# Altium schematic sheet 12_fit_YK.SchDoc
size A4; SheetNumber: 3; SheetTotal: 3
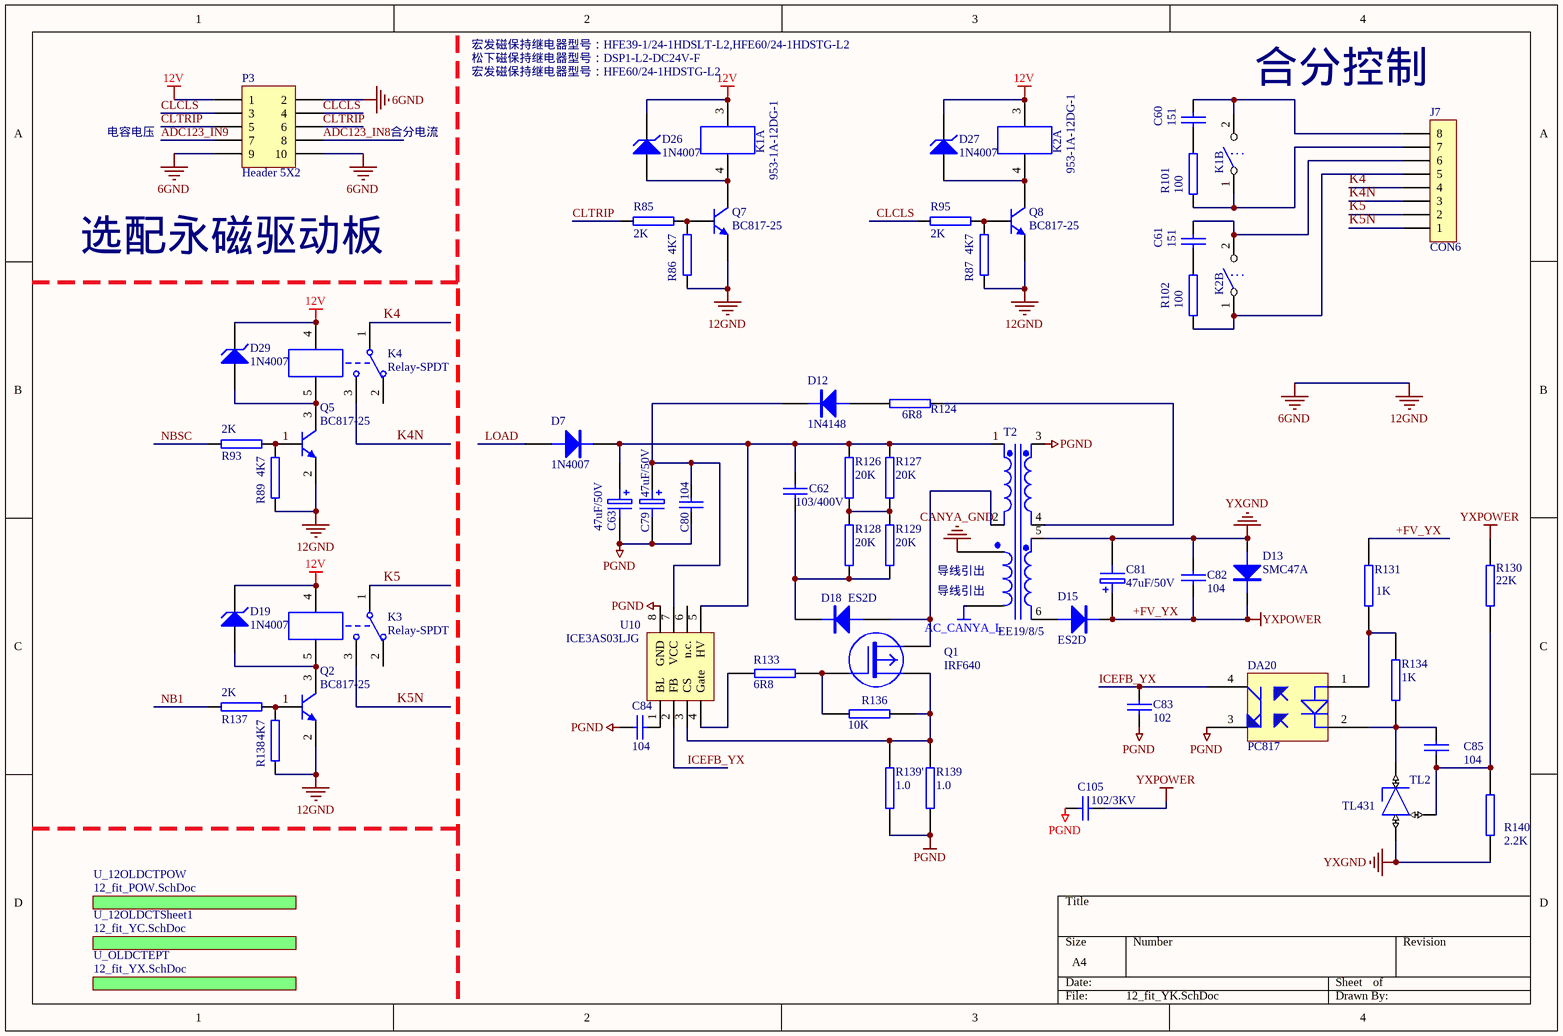
[diagram p0: 12_fit_YK.SchDoc]

## Parts
C60  151  [CAP_HV_10]
C61  151  [CAP_HV_10]
C62  103/400V  [CAP_HV_8]
C63  47uF/50V  [47u/50V]
C79  47uF/50V  [47u/50V]
C80  104  [C1206]
C81  47uF/50V  [47u/50V]
C82  104  [CBB104]
C83  102  [C1206]
C84  104  [C1206]
C85  104  [CBB104]
C105  102/3KV  [CAP_HV_8]
D7  1N4007  [DO-214AA]
D12  1N4148  [SMT_4148]
D13  SMC47A  [DO-214AB]
D15  ES2D  [DO-214AA]
D18  ES2D  [DO-214AA]
D19  1N4007  [DO-214AC]
D26  1N4007  [DO-214AC]
D27  1N4007  [DO-214AC]
D29  1N4007  [DO-214AC]
DA20  PC817  [dip4]
J7  CON6  [XR_POWER5.08_8_弯]
K1  953-1A-12DG-1  [953-1A-12DG-1]  (parts A,B of 2)
K2  953-1A-12DG-1  [953-1A-12DG-1]  (parts A,B of 2)
K3  Relay-SPDT  [JQX-115FA]
K4  Relay-SPDT  [JQX-115FA]
P3  Header 5X2  [HDR2X5]
Q1  IRF640  [TO220-IRF540]
Q2  BC817-25  [SOT-23]
Q5  BC817-25  [SOT-23]
Q7  BC817-25  [SOT-23]
Q8  BC817-25  [SOT-23]
R85  2K  [R1206]
R86  4K7  [R1206]
R87  4K7  [R1206]
R89  4K7  [R1206]
R93  2K  [R1206]
R95  2K  [R1206]
R101  100  [res-l5]
R102  100  [res-l5]
R124  6R8  [R1206]
R126  20K  [R1206]
R127  20K  [R1206]
R128  20K  [R1206]
R129  20K  [R1206]
R130  22K  [R1206]
R131  1K  [R1206]
R133  6R8  [R1206]
R134  1K  [R1206]
R136  10K  [R1206]
R137  2K  [R1206]
R138  4K7  [R1206]
R139  1.0  [R2512]
R139'  1.0  [R2512]
R140  2.2K  [R1206]
T2  EE19/8/5  [EE19/8/5]
TL2  TL431  [SOT-23]
U10  ICE3AS03LJG  [SO8]

## Sub-sheets
U_12OLDCTPOW = 12_fit_POW.SchDoc: no entries
U_12OLDCTSheet1 = 12_fit_YC.SchDoc: no entries
U_OLDCTEPT = 12_fit_YX.SchDoc: no entries

## Nets
12GND: P3.2 P3.9 P3.10 Q2.2(E) Q5.2(E) Q7.2(E) Q8.2(E) R86.1 R87.1 R89.1 R138.1  [also labelled 6GND]
12V: D19.2(K) D26.2(K) D27.2(K) D29.2(K) K1.3 K2.3 K3.4 K4.4 P3.1
+FV_YX: C81.1 C82.1 C105.2 D13.2(K) D15.2(K) R130.2 R131.2  [also labelled YXPOWER]
PGND: C63.2 C79.2 C80.1 C83.1 C84.1 C105.1 DA20.3 R139.1 R139'.1 T2.3(Sec1+) U10.8(GND)
YXGND: C81.2 C82.2 D13.1(A) R140.1 T2.5(Sec2+) TL2.3(A)
ADC123_IN8: P3.8
ADC123_IN9: P3.7
CLCLS: P3.3 P3.4 R95.1
CLTRIP: P3.5 P3.6 R85.1
ICEFB_YX: C83.2 DA20.4 U10.2(FB)
K4: J7.4 K4.1
K4N: J7.3 K4.3
K5: J7.2 K3.1
K5N: J7.1 K3.3
LOAD: D7.1(A)
NB1: R137.1
NBSC: R93.1
NetC60_1: C60.1 R101.1
NetC60_2: C60.2 J7.8 K1.2
NetC61_1: C61.1 J7.6 K2.2
NetC61_2: C61.2 R102.1
NetC62_1: C62.1 D18.2(K) R128.1 R129.1
NetC62_2: C62.2 C63.1 D7.2(K) R126.2 R127.2 T2.1(Pri+) U10.5(HV)
NetC79_1: C79.1 C80.2 D12.2(K) U10.7(VCC)
NetC84_2: C84.2 U10.1(BL)
NetC85_1: C85.1 DA20.2 R134.1 TL2.1(K)
NetC85_2: C85.2 R130.1 R140.2 TL2.2(R)
NetD12_1: D12.1(A) R124.1
NetD15_1: D15.1(A) T2.6(Sec2-)
NetD18_1: D18.1(A) Q1.2(D) T2.2(Pri-)
NetD19_1: D19.1(A) K3.5 Q2.3(C)
NetD26_1: D26.1(A) K1.4 Q7.3(C)
NetD27_1: D27.1(A) K2.4 Q8.3(C)
NetD29_1: D29.1(A) K4.5 Q5.3(C)
NetDA20_1: DA20.1 R131.1 R134.2
NetJ7_5: J7.5 K2.1 R102.2
NetJ7_7: J7.7 K1.1 R101.2
NetQ1_1: Q1.1(G) R133.1 R136.2
NetQ1_3: Q1.3(S) R136.1 R139.2 R139'.2 U10.3(CS)
NetQ2_1: Q2.1(B) R137.2 R138.2
NetQ5_1: Q5.1(B) R89.2 R93.2
NetQ7_1: Q7.1(B) R85.2 R86.2
NetQ8_1: Q8.1(B) R87.2 R95.2
NetR124_2: R124.2 T2.4(Sec1-)
NetR126_1: R126.1 R127.1 R128.2 R129.2
NetR133_2: R133.2 U10.4(Gate)

Not connected (* = marked no-connect by the designer): K3 2; K4 2; U10 6(n.c.)

## Notes on the sheet
- 宏发磁保持继电器型号：HFE39-1/24-1HDSLT-L2,HFE60/24-1HDSTG-L2
- 松下磁保持继电器型号：DSP1-L2-DC24V-F
- 宏发磁保持继电器型号：HFE60/24-1HDSTG-L2
- 合分控制
- 电容电压
- 合分电流
- 选配永磁驱动板
- 导线引出
- Labels drawn without touching a wire or pin: AC_CANYA_L, CANYA_GND

## Library data of the parts
C60-C62 C83 = CAP
C63 C79 C81 = ELECTRO1: Electrolytic Capacitor
C80 C82 C84 C85 C105 = CAP: Capacitor
D7 D12 D13 D15 D18 = DIODE
D19 D26 D27 D29 = D Zener: Zener Diode; Published: 8-Jun-2000; LatestRevisionDate: 17-Jul-2002; LatestRevisionNote: Re-released for DXP Platform.; PackageReference: DIODE-0.7; Publisher: Altium Limited; PackageDescription: Diode, Thru-Hole; 2 Leads; 0.7 in Pin Spacing
DA20 = TLP521-1
J7 = CON8: Connector
K1 K2 = RLY-STY1: RELAY
K3 K4 = Relay-SPDT: Single-Pole Dual-Throw Relay; Published: 24-Mar-1999; LatestRevisionDate: 17-Jul-2002; LatestRevisionNote: Re-released for DXP Platform.; PackageReference: MODULE5B; Publisher: Altium Limited
P3 = Header 5X2: Header, 5-Pin, Dual row; LatestRevisionDate: 17-Jul-2002; LatestRevisionNote: Re-released for DXP Platform.; Publisher: Altium Limited
Q1 = MOSFET-P1
Q2 Q5 Q7 Q8 = SOT-23 2SC3356-T1B-A    S/YS档: NPN; ComponentLink1Description: 供应商链接; ComponentLink1URL: http://www.szlcsc.com/product/details_10189.html; Package: SOT-23; Supplier: LC; SuppliersPartNumber: C9659
R85-R87 R89 R93 R95 R101 R102 R124 R126-R131 R133 R134 R136-R139 R139' R140 = RES2
T2 = Trans3 Ideal: Three-winding Transformer (Ideal); Published: 25-Jan-2001; LatestRevisionDate: 17-Jul-2002; LatestRevisionNote: Re-released for DXP Platform.; PackageReference: TRF_6; Publisher: Altium Limited; PackageDescription: Transformer; 6 Leads